# Altium schematic sheet Slave_V3.SchDoc
size A2
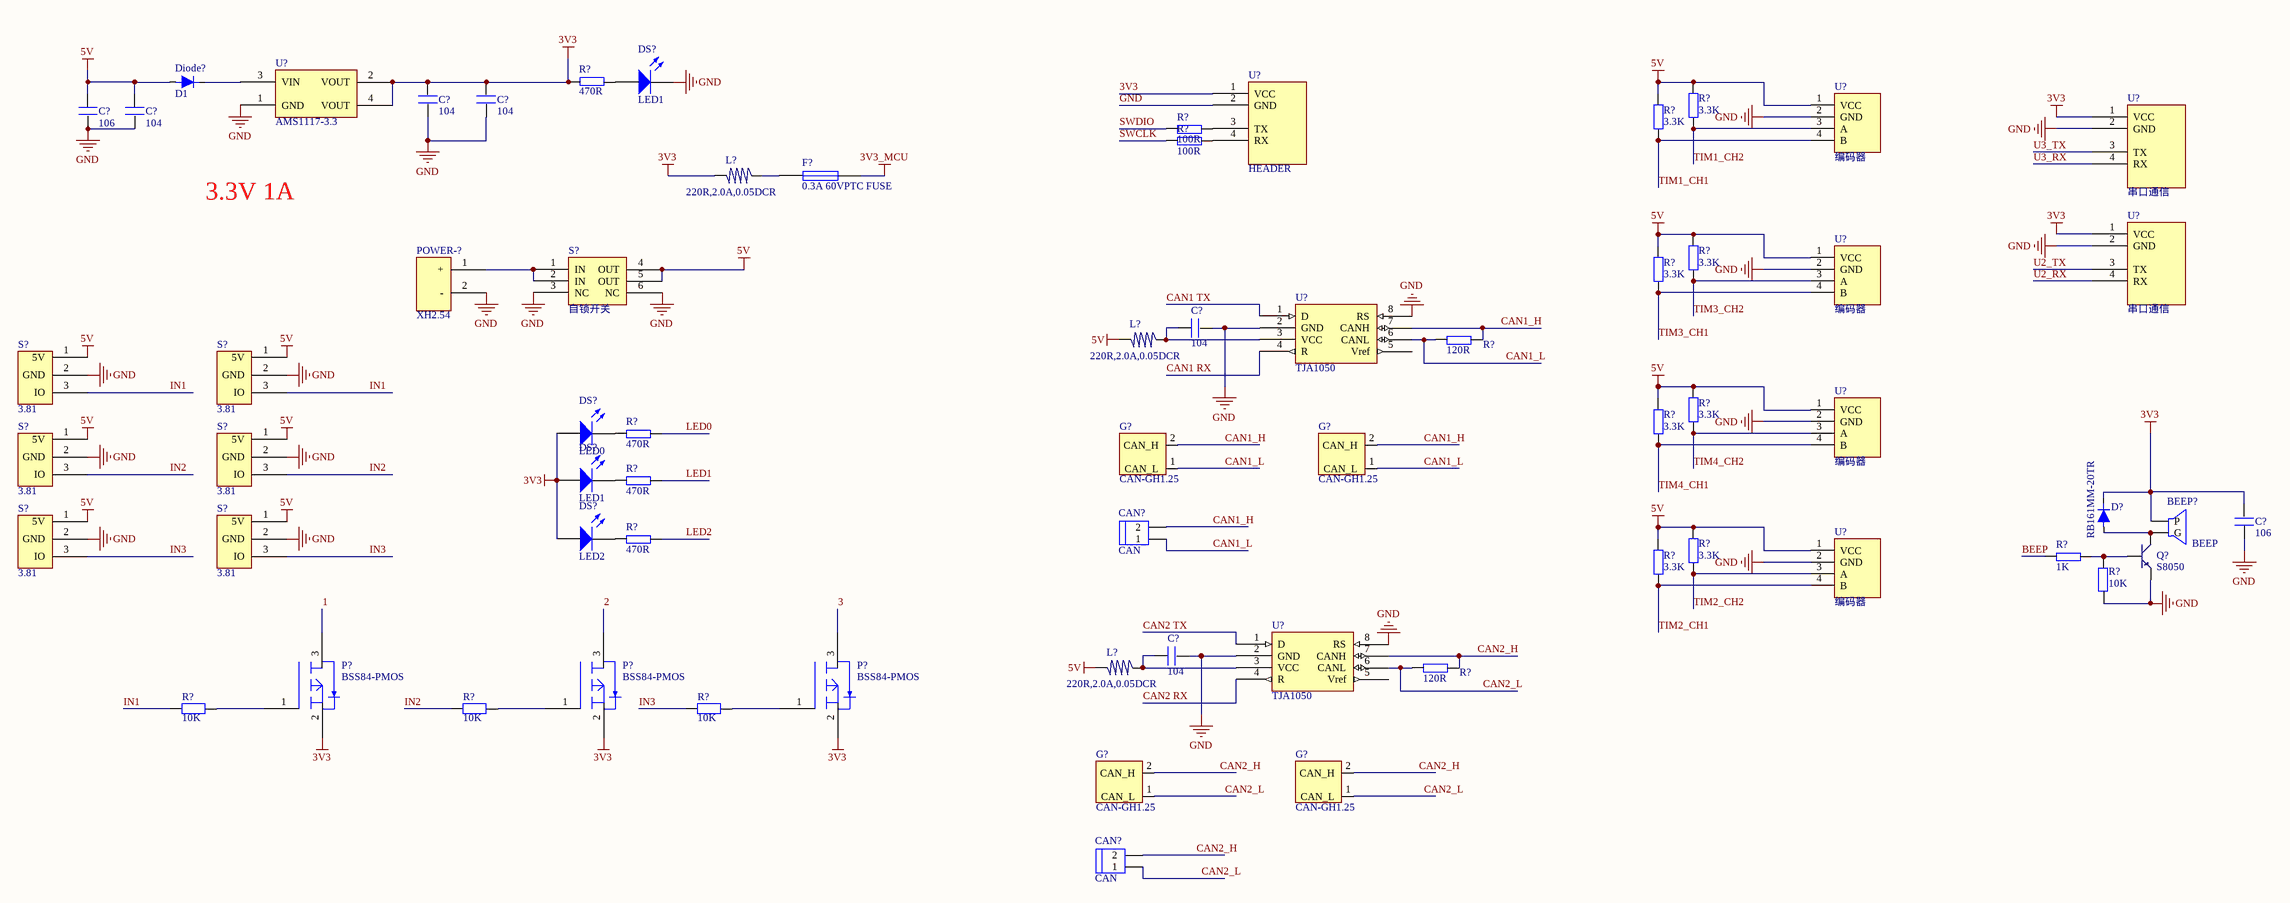
[diagram p0: Slave_V3.SchDoc]

## Parts
(Parts that share a designator on the sheet are numbered #1, #2 ... from top to bottom, then left to right.)
BEEP?  BEEP  [BELL-5]
C?#1  104  [0603P]
C?#2  104  [0603P]
C?#3  106  [0603P]
C?#4  104  [0603P]
C?#5  104  [0603P]
C?#6  106  [0603C]
C?#7  104  [0603P]
CAN?#1  CAN  [HEAD2L-0.8]
CAN?#2  CAN  [HEAD2L-0.8]
D?  RB161MM-20TR  [LC-SOD-123F]
Diode?  D1  [LC-SOD-123F]
DS?#1  LED1  [0603_LED]
DS?#2  LED0  [0603_LED]
DS?#3  LED1  [0603_LED]
DS?#4  LED2  [0603_LED]
F?  0.3A 60VPTC FUSE  [LC-1812_R]
G?#1  CAN-GH1.25  [GH1.25_1*2_lishi]
G?#2  CAN-GH1.25  [GH1.25_1*2_lishi]
G?#3  CAN-GH1.25  [GH1.25_1*2_lishi]
G?#4  CAN-GH1.25  [GH1.25_1*2_lishi]
L?#1  220R,2.0A,0.05DCR  [L_0603]
L?#2  220R,2.0A,0.05DCR  [0603P]
L?#3  220R,2.0A,0.05DCR  [0603P]
P?#1  BSS84-PMOS  [LC-SOT-23(SOT-23-3)]
P?#2  BSS84-PMOS  [LC-SOT-23(SOT-23-3)]
P?#3  BSS84-PMOS  [LC-SOT-23(SOT-23-3)]
POWER-?  XH2.54  [XH2.54-2]
Q?  S8050  [SOT-23R]
R?#1  100R  [0603P]
R?#2  100R  [0603P]
R?#3  3.3K  [0603P]
R?#4  3.3K  [0603P]
R?#5  470R  [0603P]
R?#6  120R  [0603P]
R?#7  3.3K  [0603P]
R?#8  3.3K  [0603P]
R?#9  470R  [0603R]
R?#10  470R  [0603R]
R?#11  3.3K  [0603P]
R?#12  3.3K  [0603P]
R?#13  10K  [0603R]
R?#14  470R  [0603R]
R?#15  1K  [0603R]
R?#16  3.3K  [0603P]
R?#17  3.3K  [0603P]
R?#18  120R  [0603P]
R?#19  10K  [0603P]
R?#20  10K  [0603P]
R?#21  10K  [0603P]
S?#1  自锁开关  [自锁开关5.8*5.8]
S?#2  3.81  [KF2EDG-3.81-3P-弯针]
S?#3  3.81  [KF2EDG-3.81-3P-弯针]
S?#4  3.81  [KF2EDG-3.81-3P-弯针]
S?#5  3.81  [KF2EDG-3.81-3P-弯针]
S?#6  3.81  [KF2EDG-3.81-3P-弯针]
S?#7  3.81  [KF2EDG-3.81-3P-弯针]
U?#1  AMS1117-3.3  [SOT223]
U?#2  HEADER  [XH2.54-4]
U?#3  编码器  [XH2.54-4]
U?#4  串口通信  [XH2.54-4]
U?#5  TJA1050  [SOP8]
U?#6  串口通信  [XH2.54-4]
U?#7  编码器  [XH2.54-4]
U?#8  编码器  [XH2.54-4]
U?#9  编码器  [XH2.54-4]
U?#10  TJA1050  [SOP8]

## Nets
3V3: BEEP?.1(P) C?#1.2 C?#2.2 C?#6.1 D?.2 DS?#2.1(A) DS?#3.1(A) DS?#4.1(A) L?#1.2 P?#1.2(S) P?#2.2(S) P?#3.2(S) R?#5.2 U?#1.2(VOUT) U?#1.4(VOUT) U?#2.1(VCC) U?#4.1(VCC) U?#6.1(VCC)
3V3_MCU: F?.2
5V: C?#3.2 C?#4.2 Diode?.1 L?#2.2 L?#3.2 R?#3.1 R?#4.1 R?#7.1 R?#8.1 R?#11.1 R?#12.1 R?#16.1 R?#17.1 S?#1.4(OUT) S?#1.5(OUT) S?#2.1(5V) S?#3.1(5V) S?#4.1(5V) S?#5.1(5V) S?#6.1(5V) S?#7.1(5V) U?#3.1(VCC) U?#7.1(VCC) U?#8.1(VCC) U?#9.1(VCC)
GND: C?#1.1 C?#2.1 C?#3.1 C?#4.1 C?#5.2 C?#6.2 C?#7.2 DS?#1.2(K) POWER-?.2(-) Q?.1(E) R?#13.2 S?#1.3(NC) S?#1.6(NC) S?#2.2(GND) S?#3.2(GND) S?#4.2(GND) S?#5.2(GND) S?#6.2(GND) S?#7.2(GND) U?#1.1(GND) U?#2.2(GND) U?#3.2(GND) U?#4.2(GND) U?#5.2(GND) U?#5.8(RS) U?#6.2(GND) U?#7.2(GND) U?#8.2(GND) U?#9.2(GND) U?#10.2(GND) U?#10.8(RS)
1: P?#1.3(D)
2: P?#2.3(D)
3: P?#3.3(D)
BEEP: R?#15.1
CAN1 RX: U?#5.4(R)
CAN1 TX: U?#5.1(D)
CAN1_H: CAN?#1.2 G?#1.2(CAN_H) G?#2.2(CAN_H) R?#6.2 U?#5.7(CANH)
CAN1_L: CAN?#1.1 G?#1.1(CAN_L) G?#2.1(CAN_L) R?#6.1 U?#5.6(CANL)
CAN2 RX: U?#10.4(R)
CAN2 TX: U?#10.1(D)
CAN2_H: CAN?#2.2 G?#3.2(CAN_H) G?#4.2(CAN_H) R?#18.2 U?#10.7(CANH)
CAN2_L: CAN?#2.1 G?#3.1(CAN_L) G?#4.1(CAN_L) R?#18.1 U?#10.6(CANL)
IN1: R?#19.1 S?#2.3(IO) S?#3.3(IO)
IN2: R?#20.1 S?#4.3(IO) S?#5.3(IO)
IN3: R?#21.1 S?#6.3(IO) S?#7.3(IO)
LED0: R?#9.2
LED1: R?#10.2
LED2: R?#14.2
SWCLK: R?#2.1
SWDIO: R?#1.1
TIM1_CH1: R?#4.2 U?#3.4(B)
TIM1_CH2: R?#3.2 U?#3.3(A)
TIM2_CH1: R?#17.2 U?#9.4(B)
TIM2_CH2: R?#16.2 U?#9.3(A)
TIM3_CH1: R?#8.2 U?#7.4(B)
TIM3_CH2: R?#7.2 U?#7.3(A)
TIM4_CH1: R?#12.2 U?#8.4(B)
TIM4_CH2: R?#11.2 U?#8.3(A)
U2_RX: U?#6.4(RX)
U2_TX: U?#6.3(TX)
U3_RX: U?#4.4(RX)
U3_TX: U?#4.3(TX)
NetBEEP?_2: BEEP?.2(G) D?.1 Q?.3(C)
NetC?#5_1: C?#5.1 L?#2.1 U?#5.3(VCC)
NetC?#7_1: C?#7.1 L?#3.1 U?#10.3(VCC)
NetDiode?_2: Diode?.2 U?#1.3(VIN)
NetDS?#1_1: DS?#1.1(A) R?#5.1
NetDS?#2_2: DS?#2.2(K) R?#9.1
NetDS?#3_2: DS?#3.2(K) R?#10.1
NetDS?#4_2: DS?#4.2(K) R?#14.1
NetF?_1: F?.1 L?#1.1
NetP?#1_1: P?#1.1(G) R?#19.2
NetP?#2_1: P?#2.1(G) R?#20.2
NetP?#3_1: P?#3.1(G) R?#21.2
NetPOWER-?_1: POWER-?.1(+) S?#1.1(IN) S?#1.2(IN)
NetQ?_2: Q?.2(B) R?#13.1 R?#15.2
NetR?#1_2: R?#1.2 U?#2.3(TX)
NetR?#2_2: R?#2.2 U?#2.4(RX)

Not connected (* = marked no-connect by the designer): U?#5 5(Vref); U?#10 5(Vref)

## Notes on the sheet
- 3.3V 1A

## Library data of the parts
C?#1-C?#7 = C
CAN?#1 CAN?#2 = HEAD2
D? Diode? = 肖特基
DS?#1-DS?#4 = LED2: Typical RED, GREEN, YELLOW, AMBER GaAs LED; Published: 8-Jun-2000; LatestRevisionDate: 17-Jul-2002; LatestRevisionNote: Re-released for DXP Platform.; PackageDocument: Feb-2002; PackageReference: 3.2X1.6X1.1; Publisher: Altium Limited
F? = Fuse 1_2: Fuse; Published: 8-Jun-2000; LatestRevisionDate: 17-Jul-2002; LatestRevisionNote: Re-released for DXP Platform.; PackageReference: PIN-W2/E2.8; Publisher: Altium Limited; PackageDescription: Thru-Hole; 2 Leads
G?#1-G?#4 = GH1.25-CAN
L?#1-L?#3 = L
POWER-? = XH2.54-2
Q? = NPN: 8050/BCW846/BCW847
R?#1 R?#2 R?#5 R?#6 R?#9 R?#10 R?#13-R?#15 R?#18 = R
R?#3 R?#4 R?#7 R?#8 R?#11 R?#12 R?#16 R?#17 R?#19-R?#21 = R-0805
S?#1 = Switch_5.8
S?#2-S?#7 = 槽型开关
U?#1 = AMS1117
U?#2 U?#4 U?#6 = XH2.54插座-4P
U?#3 U?#7-U?#9 = 编码器4P
U?#5 U?#10 = SN65HVD230D